# EAGLE design Ble_multimeter (EAGLE 8.4.3)
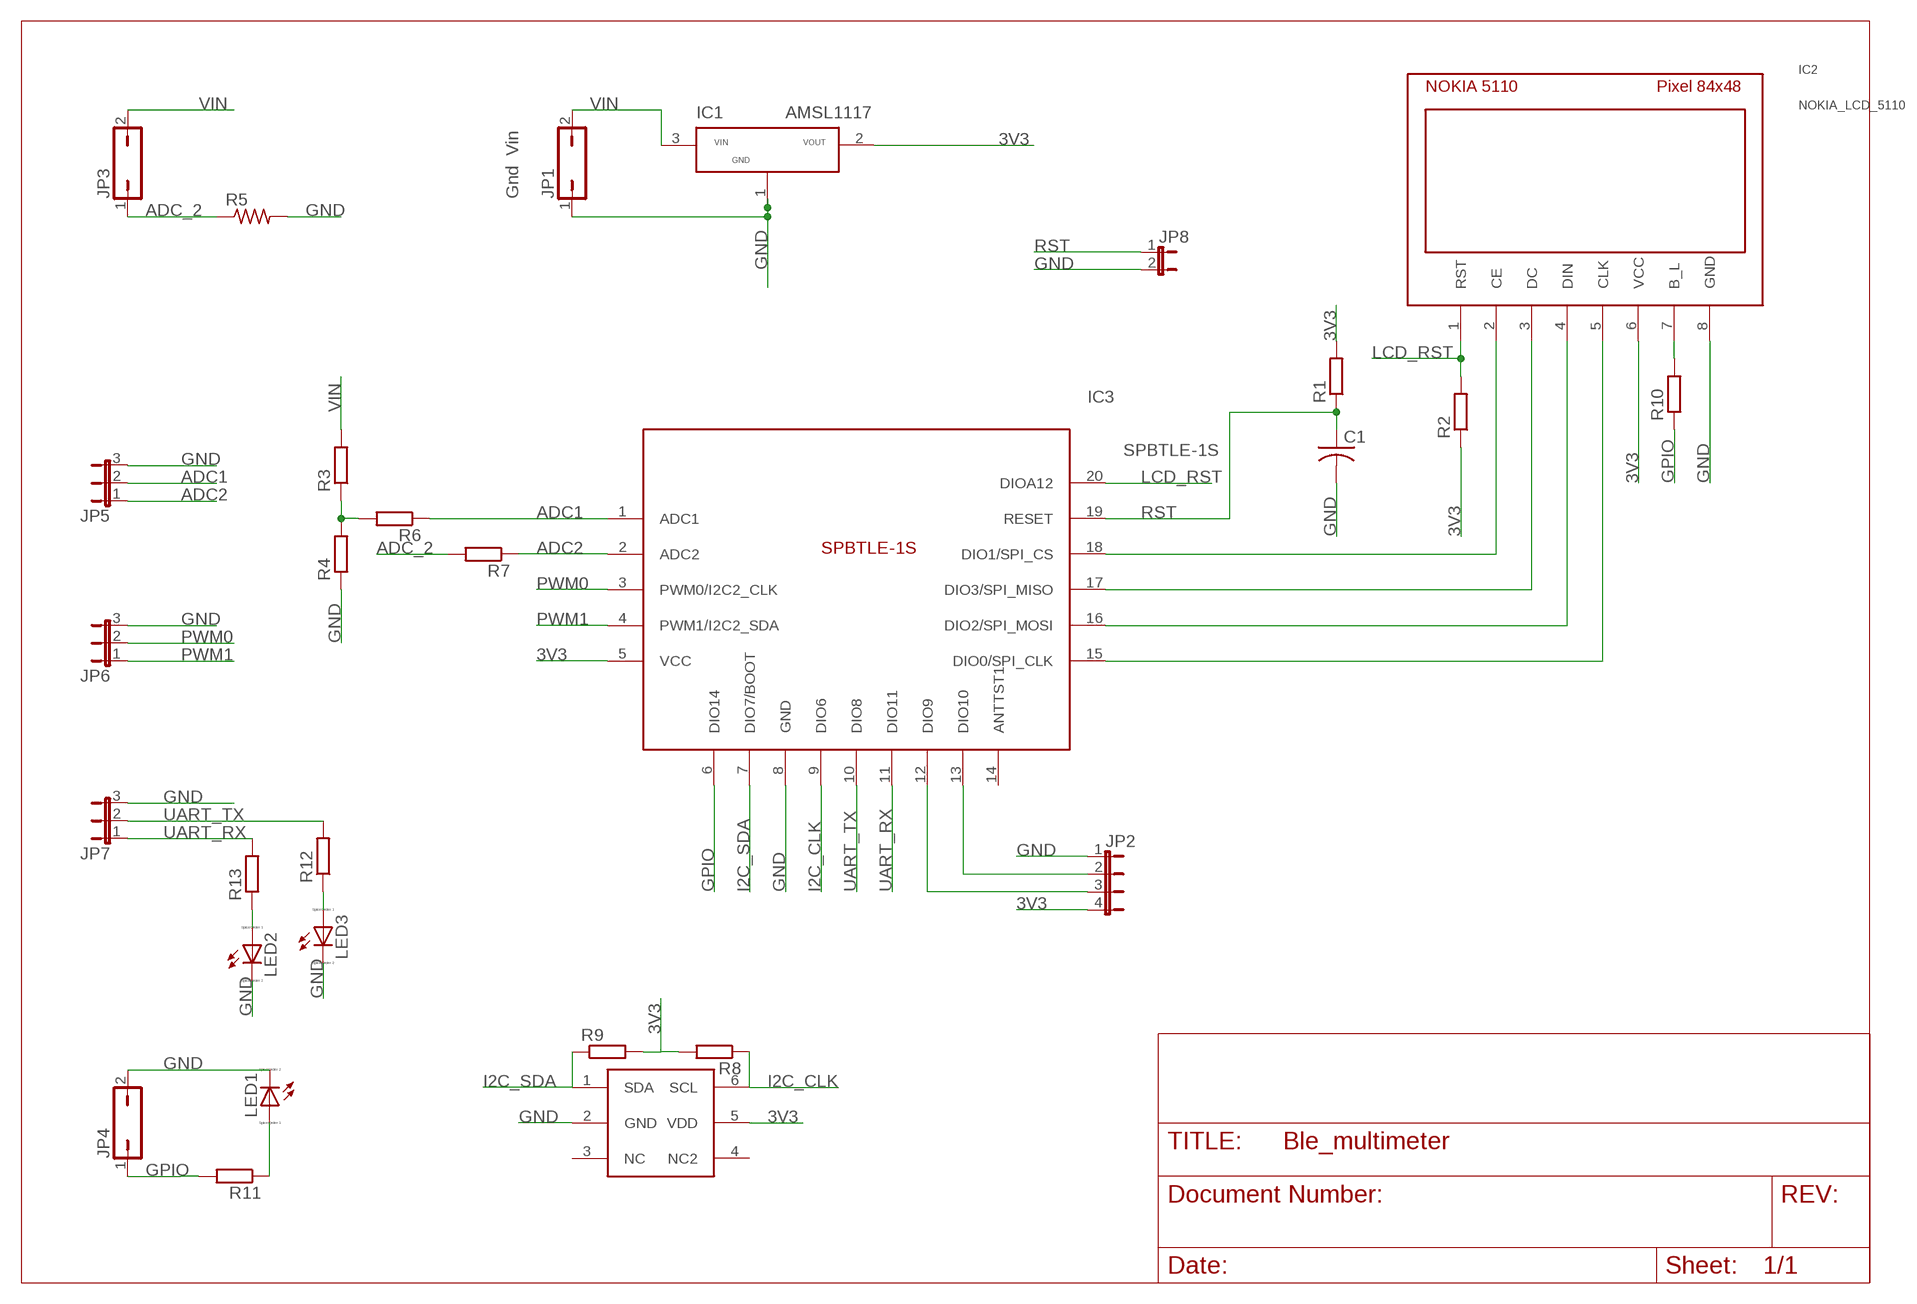
[diagram p0: schematic, sheet 1]

## Parts
C1  C-USC0805  [C0805]
IC1  AMSL1117  [SOT223]
IC2  NOKIA_LCD_5110  [NOKIA_LCD_5110_8PIN]
IC3  SPBTLE-1S  [SPBTLE-1S_SMD20]
IC4  HDC1080  [6_PIN_PWSON]
JP1  JP1Q  [JP1]
JP2  JP4E  [JP4]
JP3  JP1Q  [JP1]
JP4  JP1Q  [JP1]
JP5  JP2E  [JP2]
JP6  JP2E  [JP2]
JP7  JP2E  [JP2]
JP8  JP1E  [JP1]
LED1  LED_E  [LED_1206]
LED2  LED_E  [LED_1206]
LED3  LED_E  [LED_1206]
R1  R-EU_M1206  [M1206]
R2  R-EU_M1206  [M1206]
R3  R-EU_M1206  [M1206]
R4  R-EU_M1206  [M1206]
R5  R-US_0414/5V  [0414V]
R6  R-EU_M1206  [M1206]
R7  R-EU_M1206  [M1206]
R8  R-EU_M1206  [M1206]
R9  R-EU_M1206  [M1206]
R10  R-EU_M1206  [M1206]
R11  R-EU_M1206  [M1206]
R12  R-EU_M1206  [M1206]
R13  R-EU_M1206  [M1206]

## Nets
3V3: IC1.2 IC2.6(VCC) IC3.5(VCC) IC4.5(VDD) JP2.4 R1.2 R2.1 R8.2 R9.2
ADC1: IC3.1(ADC1) JP5.2 R6.1
ADC2: IC3.2(ADC2) JP5.1 R7.1
ADC_2: JP3.1 R5.1 R7.2
GND: C1.2 IC1.1 IC2.8(GND) IC3.8(GND) IC4.2(GND) JP1.1 JP2.1 JP4.2 JP5.3 JP6.3 JP7.3 JP8.2 LED1.C LED2.C LED3.C R4.1 R5.2
GPIO: IC3.6(DIO14) JP4.1 R10.1 R11.2
I2C_CLK: IC3.9(DIO6) IC4.6(SCL) R8.1
I2C_SDA: IC3.7(DIO7/BOOT) IC4.1(SDA) R9.1
LCD_RST: IC2.1(RST) IC3.20(DIOA12) R2.2
N$1: IC2.2(CE) IC3.18(DIO1/SPI_CS)
N$2: IC2.4(DIN) IC3.16(DIO2/SPI_MOSI)
N$3: IC2.5(CLK) IC3.15(DIO0/SPI_CLK)
N$4: IC2.7(B_L) R10.2
N$5: IC2.3(DC) IC3.17(DIO3/SPI_MISO)
N$7: IC3.13(DIO10) JP2.2
N$8: IC3.12(DIO9) JP2.3
N$10: R3.1 R4.2 R6.2
N$11: LED3.A R12.1
N$12: LED2.A R13.1
N$13: LED1.A R11.1
PWM0: IC3.3(PWM0/I2C2_CLK) JP6.2
PWM1: IC3.4(PWM1/I2C2_SDA) JP6.1
RST: C1.1 IC3.19(RESET) JP8.1 R1.1
UART_RX: IC3.11(DIO11) JP7.1 R13.2
UART_TX: IC3.10(DIO8) JP7.2 R12.2
VIN: IC1.3 JP1.2 JP3.2 R3.2
Unconnected: IC3.14(ANTTST1) IC4.3(NC) IC4.4(NC2)

## Notes on the sheet
- Gnd  Vin

## Library data of the parts
C1 = rcl:C-US: CAPACITOR, American symbol
IC1 = Akash_pck:AMSL1117: AMS FIXED VOLTAGE REGULATOR
IC2 = Akash_pck:NOKIA_LCD_5110
IC3 = Akash_pck:SPBTLE-1S: The SPBTLE-1S is a Bluetooth® low Energy System-on-Chip application processor certified module, compliant with BT specifications v4.2 and BQE qualified.
IC4 = Akash_pck:HDC1080: The HDC1080 is a digital humidity sensor with integrated temperature sensor that provides excellent measurement accuracy at very low power.
JP1 JP3 JP4 = jumper:JP1Q: JUMPER
JP2 = jumper:JP4E: JUMPER
JP5-JP7 = jumper:JP2E: JUMPER
JP8 = jumper:JP1E: JUMPER
LED1-LED3 = eagle-ltspice:LED_E: LED Source: http://www.osram.convergy.de Source: www.luxeon.com Source: www.kingbright.com; SPICEMODEL: NONE; SPICEPREFIX: D; SPICETYPE: diode
R1-R4 R6-R13 = rcl:R-EU_: RESISTOR, European symbol
R5 = rcl:R-US_: RESISTOR, American symbol

## Board
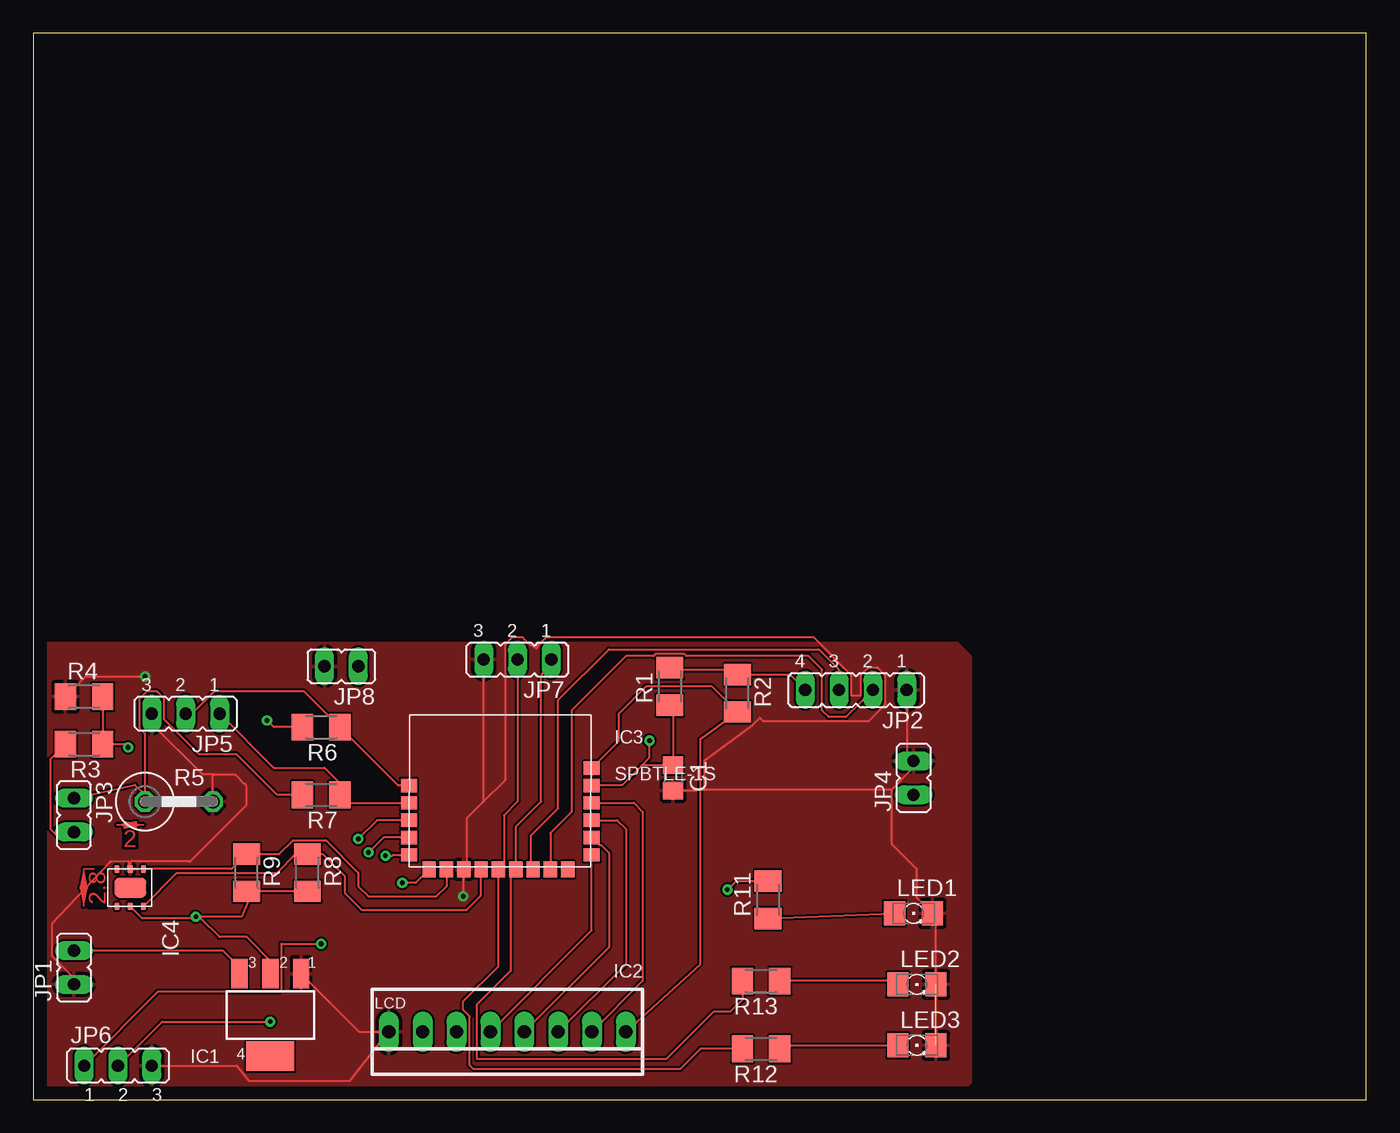
[diagram p1: board, top side]
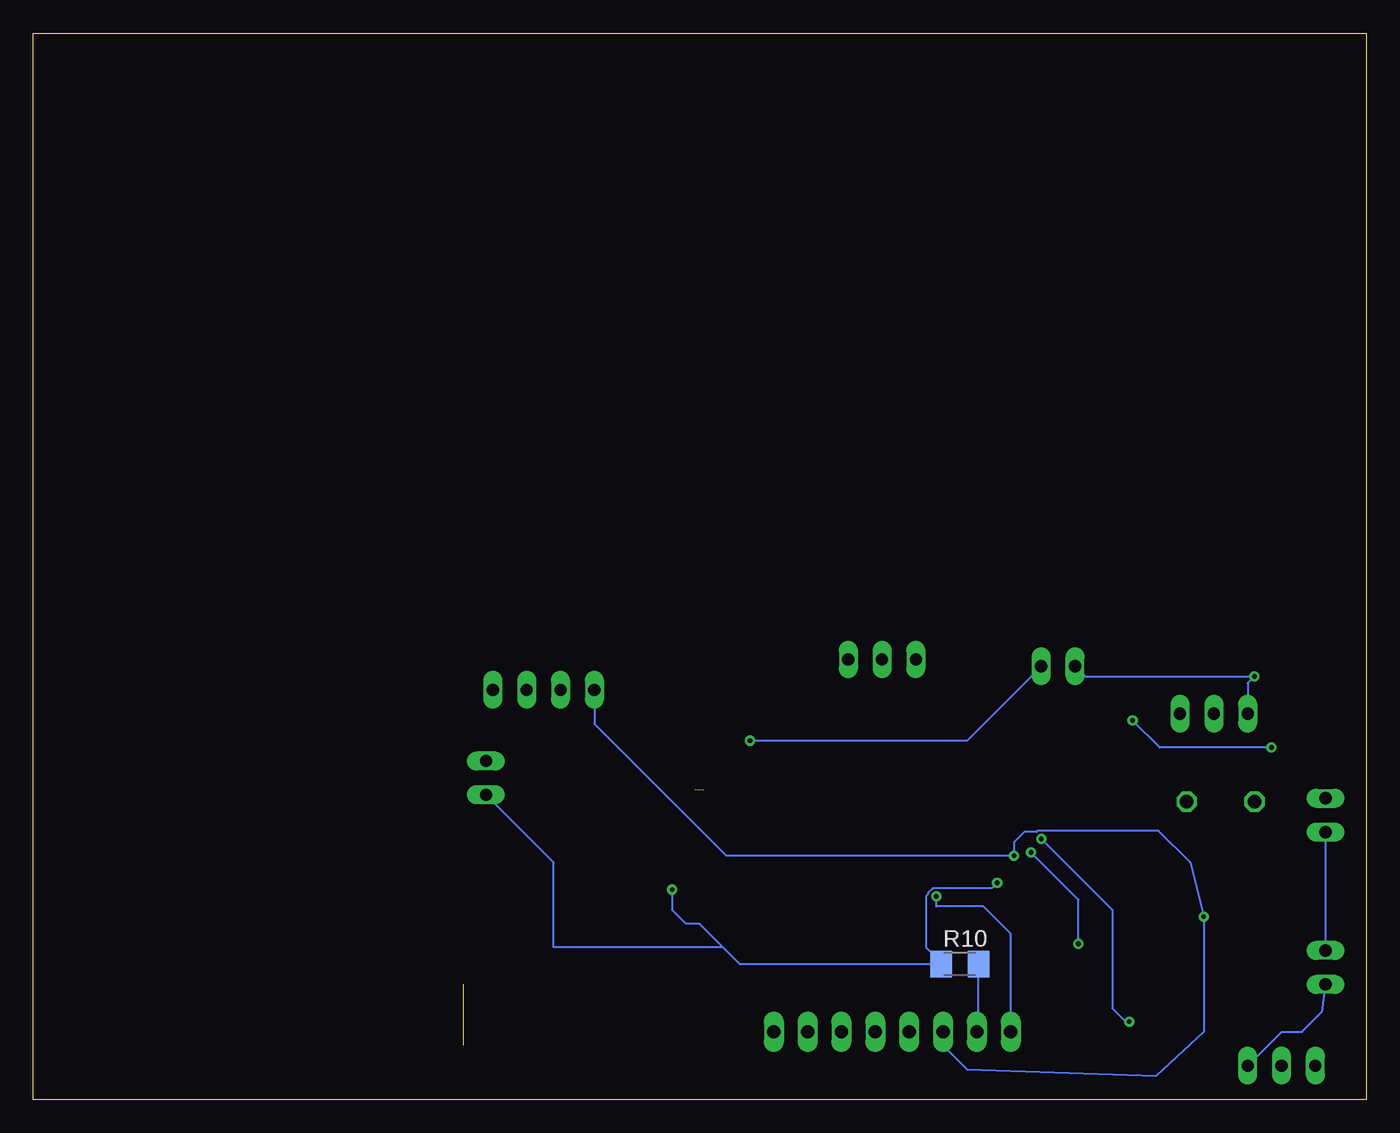
[diagram p2: board, bottom side, seen from below]

Size 100 x 80 mm. Coordinates in mm from the lower left corner, seen from the top.
Outline: 0,0 100,0 100,80 0,80 0,0
Copper layers (1*16): Top 0.035mm / dielectric 1.5mm / Bottom 0.035mm
Design rules "default": minimum track width 6mil, minimum drill 0.35mm, track to track 6mil, track to pad 6mil, pad to pad 6mil, via to via 6mil, smd to smd 6mil, copper to edge 40mil, drill to drill 6mil, minimum pad ring 10mil, minimum via ring 8mil, stop-mask expansion 4mil, vias tented up to drill 0mil, thermal gap 10mil

### Footprints (pad centres in the part's own frame; a part is rotated, then mirrored left to right if it is on the bottom)
C0805 = smd 1.3 x 1.5: 1 -0.95,0; 2 0.95,0
SOT223 = smd 1.219 x 2.235: 1 -2.311,-3.099; 2 0,-3.099; 3 2.311,-3.099 | smd 3.6 x 2.2: 4 0,3.099
NOKIA_LCD_5110_8PIN = drill 1 long: 1 -8.89,-2.54; 2 -6.35,-2.54; 3 -3.81,-2.54; 4 -1.27,-2.54; 5 1.27,-2.54; 6 3.81,-2.54; 7 6.35,-2.54; 8 8.89,-2.54
SPBTLE-1S_SMD20 = smd 1.2 x 1: 1 -6.1,0.7; 2 -6.1,-0.6; 3 -6.1,-1.9; 4 -6.1,-3.2; 5 -6.1,-4.5; 15 7.6,-4.5; 16 7.6,-3.2; 17 7.6,-1.9; 18 7.6,-0.6; 19 7.6,0.7; 20 7.6,2 | smd 1 x 1.2: 6 -4.6,-5.6; 7 -3.3,-5.6; 8 -2,-5.6; 9 -0.7,-5.6; 10 0.6,-5.6; 11 1.9,-5.6; 12 3.2,-5.6; 13 4.5,-5.6; 14 5.8,-5.6
6_PIN_PWSON = smd 0.6 x 0.4: 1 -1.8,0.4; 2 -1.8,-0.6; 3 -1.8,-1.6; 4 1,-1.6; 5 1,-0.6; 6 1,0.4 | smd 1.5 x 2.4: P$7 -0.4,-0.6
JP1 = drill 0.914 long: 1 0,-1.27; 2 0,1.27
JP4 = drill 0.914 long: 1 -3.81,0; 2 -1.27,0; 3 1.27,0; 4 3.81,0
JP2 = drill 0.914 long: 1 -2.54,0; 2 0,0; 3 2.54,0
LED_1206 = smd 1.6 x 1.803: A -1.422,0; C 1.422,0
M1206 = smd 1.6 x 2: 1 -1.4,0; 2 1.4,0
0414V = drill 1.016 octagon: 1 -2.54,0; 2 2.54,0

### Placement (x,y rotation side)
C1  48.01,24.13 270 top
IC1  17.78,6.35 180 top
IC2  35.56,2.54 180 top
IC3  34.29,22.86 0 top
IC4  7.87,15.49 270 top
JP1  3.05,9.91 0 top
JP2  61.72,30.73 180 top
JP3  3.05,21.34 180 top
JP4  66.04,24.13 0 top
JP5  11.43,28.96 180 top
JP6  6.35,2.54 0 top
JP7  36.32,33.02 180 top
JP8  23.11,32.51 90 top
LED1  66.04,13.97 0 top
LED2  66.29,8.64 0 top
LED3  66.29,4.06 0 top
R1  47.75,30.99 90 top
R2  52.83,30.48 270 top
R3  3.81,26.67 180 top
R4  3.81,30.23 0 top
R5  10.92,22.35 0 top
R6  21.59,27.94 180 top
R7  21.59,22.86 180 top
R8  20.57,17.02 270 top
R9  16,17.02 270 top
R10  30.48,10.16 0 bottom
R11  55.12,14.99 90 top
R12  54.61,3.81 180 top
R13  54.61,8.89 180 top

### Tracks (layer width: path | path; a pad name or v marks a point on that pad's centre or on a via)
3V3  (via drill 0.35)
  Top 0.152: IC3.5 27,18.36 26.92,18.29 v26.42,18.29 | 12.57,13.59 13.97,12.19 16,12.19 18.03,10.16 17.78,9.91 IC1.2 | 12.57,13.59 v12.19,13.72 | IC4.5 8.18,13.59 12.45,13.59 | 12.45,13.59 12.57,13.59 | v12.19,13.72 12.45,13.59 | v12.19,13.72 15.62,13.72 16.19,15.05 | R8.2 16.25,15.62 16.19,15.05 | R9.2 16.39,15.62 16.19,15.05 | JP2.4 56.77,31.88 53.09,31.88 | 53.09,31.88 R2.1 | R1.2 47.88,32.26 52.32,32.26 52.7,31.88 53.09,31.88 | JP2.4 57.91,30.23 | JP2.4 58.04,30.61
  Bottom 0.152: IC2.6 31.75,4.06 29.97,2.29 15.75,1.78 12.19,5.08 v12.19,13.72 13.21,17.78 15.59,20.16 24.64,20.16 24.73,20.07 25.65,20.07 26.42,19.3 v26.42,18.29 48.01,18.29 57.91,28.19 JP2.4
ADC1
  Top 0.152: IC3.1 27.37,23.56 R6.1 20.32,30.61 13.58,30.61 11.93,28.96 JP5.2
ADC2
  Top 0.152: 23.31,22.54 R7.1 | 23.31,22.54 23.59,22.26 IC3.2 | JP5.1 18.03,24.89 21.84,24.89 23.31,23.43 23.31,22.54
ADC_2
  Top 0.152: R7.2 18.29,22.86 15.24,25.91 12.44,25.91 9.83,28.52 9.83,30.06 9.28,30.61 8.5,30.61 7.95,30.06 7.95,27.86 8.38,27.42 8.38,22.86 | JP3.1 7.62,23.62 8.38,22.86 | R5.1 8.38,22.86
GND  (via drill 0.35)  (2 unrouted)
  Top 0.152: IC1.1 24.46,5.08 IC2.8 23.77,1.41 16.14,1.41 15.27,2.54 JP6.3 | 15.91,23.62 15.91,23.71 | v32.26,15.24 32.26,17.23 IC3.8 32.51,17.48 32.51,21.08 33.78,22.35 | JP5.3 8.89,28.19 12.7,24.38 13.46,24.38 | 13.46,24.38 15.15,24.38 15.91,23.62 | 33.78,22.35 JP7.3 | R5.2 13.46,24.38 | R4.1 3.93,31.75 v8.38,31.75 | LED3.C 67.72,13.72 LED1.C 66.29,15.14 66.29,17.27 64.39,19.18 64.39,23.25 | JP2.1 65.53,25.91 JP4.2 66.04,24.9 64.39,23.25 | 7.25,17.8 7.26,17.78 | 7.26,17.78 IC4.2 7.13,17.34 7.16,17.87 5.78,17.82 1.4,13.18 1.4,10.79 3.05,9.14 JP1.1 | 11.81,17.91 11.73,17.82 | 11.81,17.91 16,22.1 16,23.53 15.91,23.62 | 7.26,17.78 7.39,17.91 11.81,17.91 | 64.39,23.25 50.34,23.25 50.34,25.45 53.93,28.05 54.51,28.63 54.75,28.4 62.7,28.4 63.93,29.63 63.93,31.83 63.38,32.38 62.6,32.38 62.05,31.83 62.05,30.29 61.39,30.29 61.39,31.83 58.55,34.67 38.47,34.67 37.92,34.12 37.75,33.83 37.26,34.12 36.71,34.67 35.93,34.67 35.38,34.12 35.38,23.95 33.78,22.35 | C1.2 49.73,23.18
  Bottom 0.152: IC2.8 26.67,12.45 28.7,14.48 32.26,14.48 v32.26,15.24 | JP6.3 6.35,5.08 4.83,5.08 3.3,6.6 JP1.1 | JP5.3 8.89,31.24 v8.38,31.75 21.08,31.75 JP8.2
  pour Top: 0.51,34.04 0.76,34.29 69.34,34.29 70.36,33.27 70.36,1.27 69.34,0.25 1.78,0.25 1.27,0.25 0.25,1.27 0.25,32.77 0.25,34.04 0.51,34.29
GPIO  (via drill 0.35)
  Top 0.152: IC3.6 28.69,16.26 v27.69,16.26 | R11.2 52.71,16.39 v52.07,15.75
  Bottom 0.152: 32.26,10.16 R10.1 | 32.26,10.16 46.99,10.16 48.26,11.43 | 48.26,11.43 60.96,11.43 60.96,17.78 JP4.1 | v27.69,16.26 28.09,15.85 32.51,15.85 32.87,15.49 32.87,15.39 33.02,15.24 33.02,11.43 32.26,10.67 32.26,10.16 | 48.26,11.43 50.04,13.21 51.05,13.21 52.07,14.22 v52.07,15.75
I2C_CLK
  Top 0.152: IC4.6 10.77,16.99 15,16.99 15.03,17.02 18.29,17.02 19.69,18.42 R8.1 21.71,18.42 23.37,16.76 23.37,15.49 24.64,14.22 32.51,14.22 33.59,15.3 IC3.9
I2C_SDA
  Top 0.152: IC3.7 30.99,16 30.23,15.24 25.15,15.24 24.38,16 24.38,17.02 21.95,19.45 19.48,19.45 18.45,18.42 R9.1 14.88,17.29 IC4.1
LCD_RST
  Top 0.152: IC2.1 50.04,10.16 50.04,27.05 R2.2 50.92,30.99 45.97,30.99 43.94,28.96 43.94,26.91 IC3.20 41.89,24.29
N$1
  Top 0.152: IC3.18 45.05,22.26 45.72,21.59 45.72,8.89 IC2.2
N$2
  Top 0.152: IC3.16 42.46,19.09 42.59,19.09 43.18,18.49 43.18,11.43 IC2.4
N$3
  Top 0.152: IC3.15 41.89,12.68 IC2.5
N$4
  Bottom 0.152: IC2.7 29.08,5.21 R10.2
N$5
  Top 0.152: IC3.17 43.81,20.96 44.45,20.32 44.45,10.16 IC2.3
N$7
  Top 0.152: JP2.2 60.96,28.7 59.69,28.7 59.18,29.21 59.18,32.26 58.17,33.27 48.99,33.27 48.85,33.42 46.66,33.42 46.52,33.27 44.45,33.27 40.39,29.21 40.39,21.59 38.79,19.99 IC3.13
N$8
  Top 0.152: IC3.12 37.34,17.41 37.34,19.81 39.37,21.84 39.37,29.97 43.18,33.78 58.93,33.78 60.45,32.26 JP2.3
N$10  (via drill 0.35)
  Top 0.152: R4.2 R3.1 6.86,26.67 v7.11,26.42 | R6.2 18.03,27.94 v17.53,28.45
  Bottom 0.152: v7.11,26.42 15.49,26.42 v17.53,28.45
N$11
  Top 0.152: R12.1 56.26,4.06 LED3.A
N$12
  Top 0.152: LED2.A 64.62,8.89 R13.1
N$13
  Top 0.152: R11.1 LED1.A
PWM0  (via drill 0.35)
  Top 0.152: JP6.2 9.65,5.84 v17.78,5.84 | IC3.3 25.79,20.96 v24.38,19.56
  Bottom 0.152: v24.38,19.56 19.05,14.22 19.05,6.86 18.03,5.84 v17.78,5.84
PWM1  (via drill 0.35)
  Top 0.152: JP6.1 9.37,8.1 18.48,8.1 18.62,8.24 18.62,11.68 v21.59,11.68 | IC3.4 26.26,19.66 v25.15,18.54
  Bottom 0.152: v25.15,18.54 21.59,14.99 v21.59,11.68
RST  (via drill 0.35)
  Top 0.152: 46.99,29.08 R1.1 48.01,29.33 C1.1 45.65,25.08 | IC3.19 41.95,23.62 44.2,23.62 45.65,25.08 | 45.65,25.08 46.23,25.65 v46.23,26.92
  Bottom 0.152: JP8.1 29.97,26.92 v46.23,26.92
UART_RX
  Top 0.152: JP7.1 38.1,31.75 38.1,22.35 36.19,20.44 IC3.11 35.81,16.88 35.81,9.65 33.27,7.11 33.27,3.05 47.5,3.05 51.05,6.6 52.32,6.6 53.21,7.49 R13.2
UART_TX
  Top 0.152: JP7.2 36.32,22.35 35.31,21.34 35.31,17.68 IC3.10 34.89,10 32.26,7.37 32.26,6.72 32.73,6.24 32.73,2.57 33.02,2.29 48.51,2.29 50.04,3.81 R12.2
VIN
  Top 0.152: JP1.2 14.22,11.18 14.73,10.67 | 14.73,10.67 15.24,10.16 15.49,10.41 | R3.2 1.27,25.53 1.27,20.32 2.03,19.56 JP3.2 | IC1.3 15.47,9.93 14.73,10.67
  Bottom 0.152: JP1.2 JP3.2